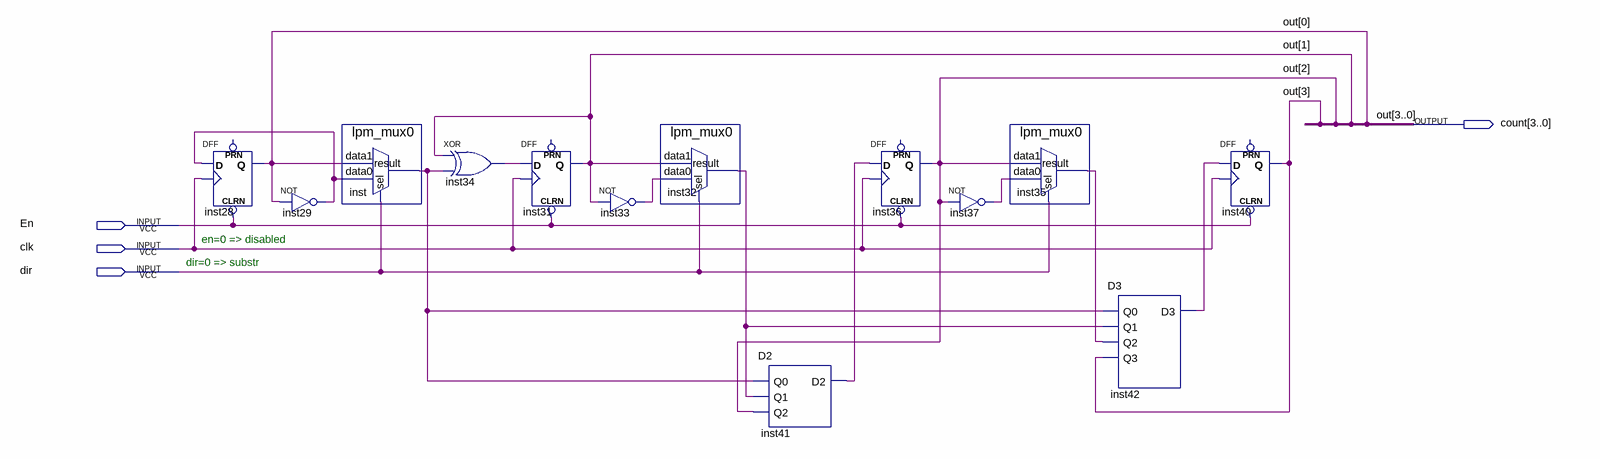
[diagram p0: schematic sheet]
// Quartus schematic counter15.bdf as structural Verilog: 13 symbols, 4 pins
module counter15 (
  input  En,
  input  clk,
  input  dir,
  output [3:0] count
);

  wire inst29_out, inst32_result, inst33_out, inst34_out, inst35_result, inst37_out, inst41_d2, inst42_d3,
       inst_result;

  DFF inst28 (.CLRN(En), .CLK(clk), .D(inst29_out), .Q(count[0]));  // open: PRN
  not inst29 (inst29_out, count[0]);
  lpm_mux0 inst (.data1(count[0]), .data0(inst29_out), .sel(dir), .result(inst_result));
  xor inst34 (inst34_out, count[1], inst_result);
  DFF inst31 (.CLRN(En), .CLK(clk), .D(inst34_out), .Q(count[1]));  // open: PRN
  not inst33 (inst33_out, count[1]);
  lpm_mux0 inst32 (.data1(count[1]), .data0(inst33_out), .sel(dir), .result(inst32_result));
  D2 inst41 (.Q0(inst_result), .Q1(inst32_result), .Q2(count[2]), .D2(inst41_d2));
  DFF inst36 (.CLRN(En), .CLK(clk), .D(inst41_d2), .Q(count[2]));  // open: PRN
  not inst37 (inst37_out, count[2]);
  lpm_mux0 inst35 (.data1(count[2]), .data0(inst37_out), .sel(dir), .result(inst35_result));
  D3 inst42 (.Q0(inst_result), .Q1(inst32_result), .Q2(inst35_result), .Q3(count[3]), .D3(inst42_d3));
  DFF inst40 (.CLRN(En), .CLK(clk), .D(inst42_d3), .Q(count[3]));  // open: PRN

  // Other names for the same wires on the sheet: out[3:0] = count

  // Notes on the sheet:
  //   en=0 => disabled
  //   dir=0 => substr
endmodule
